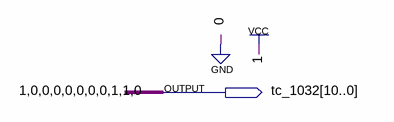
[diagram p0: schematic sheet]
// Quartus schematic tc_1032.bdf as structural Verilog: 0 symbols, 1 pins
module tc_1032 (
  output [10:0] tc_1032
);


  assign tc_1032 = 11'b10000000110;
endmodule
